# EAGLE schematic Adapter_final (EAGLE 7.7.0)

## Sheet 1 of 3: Power Supply & I/O
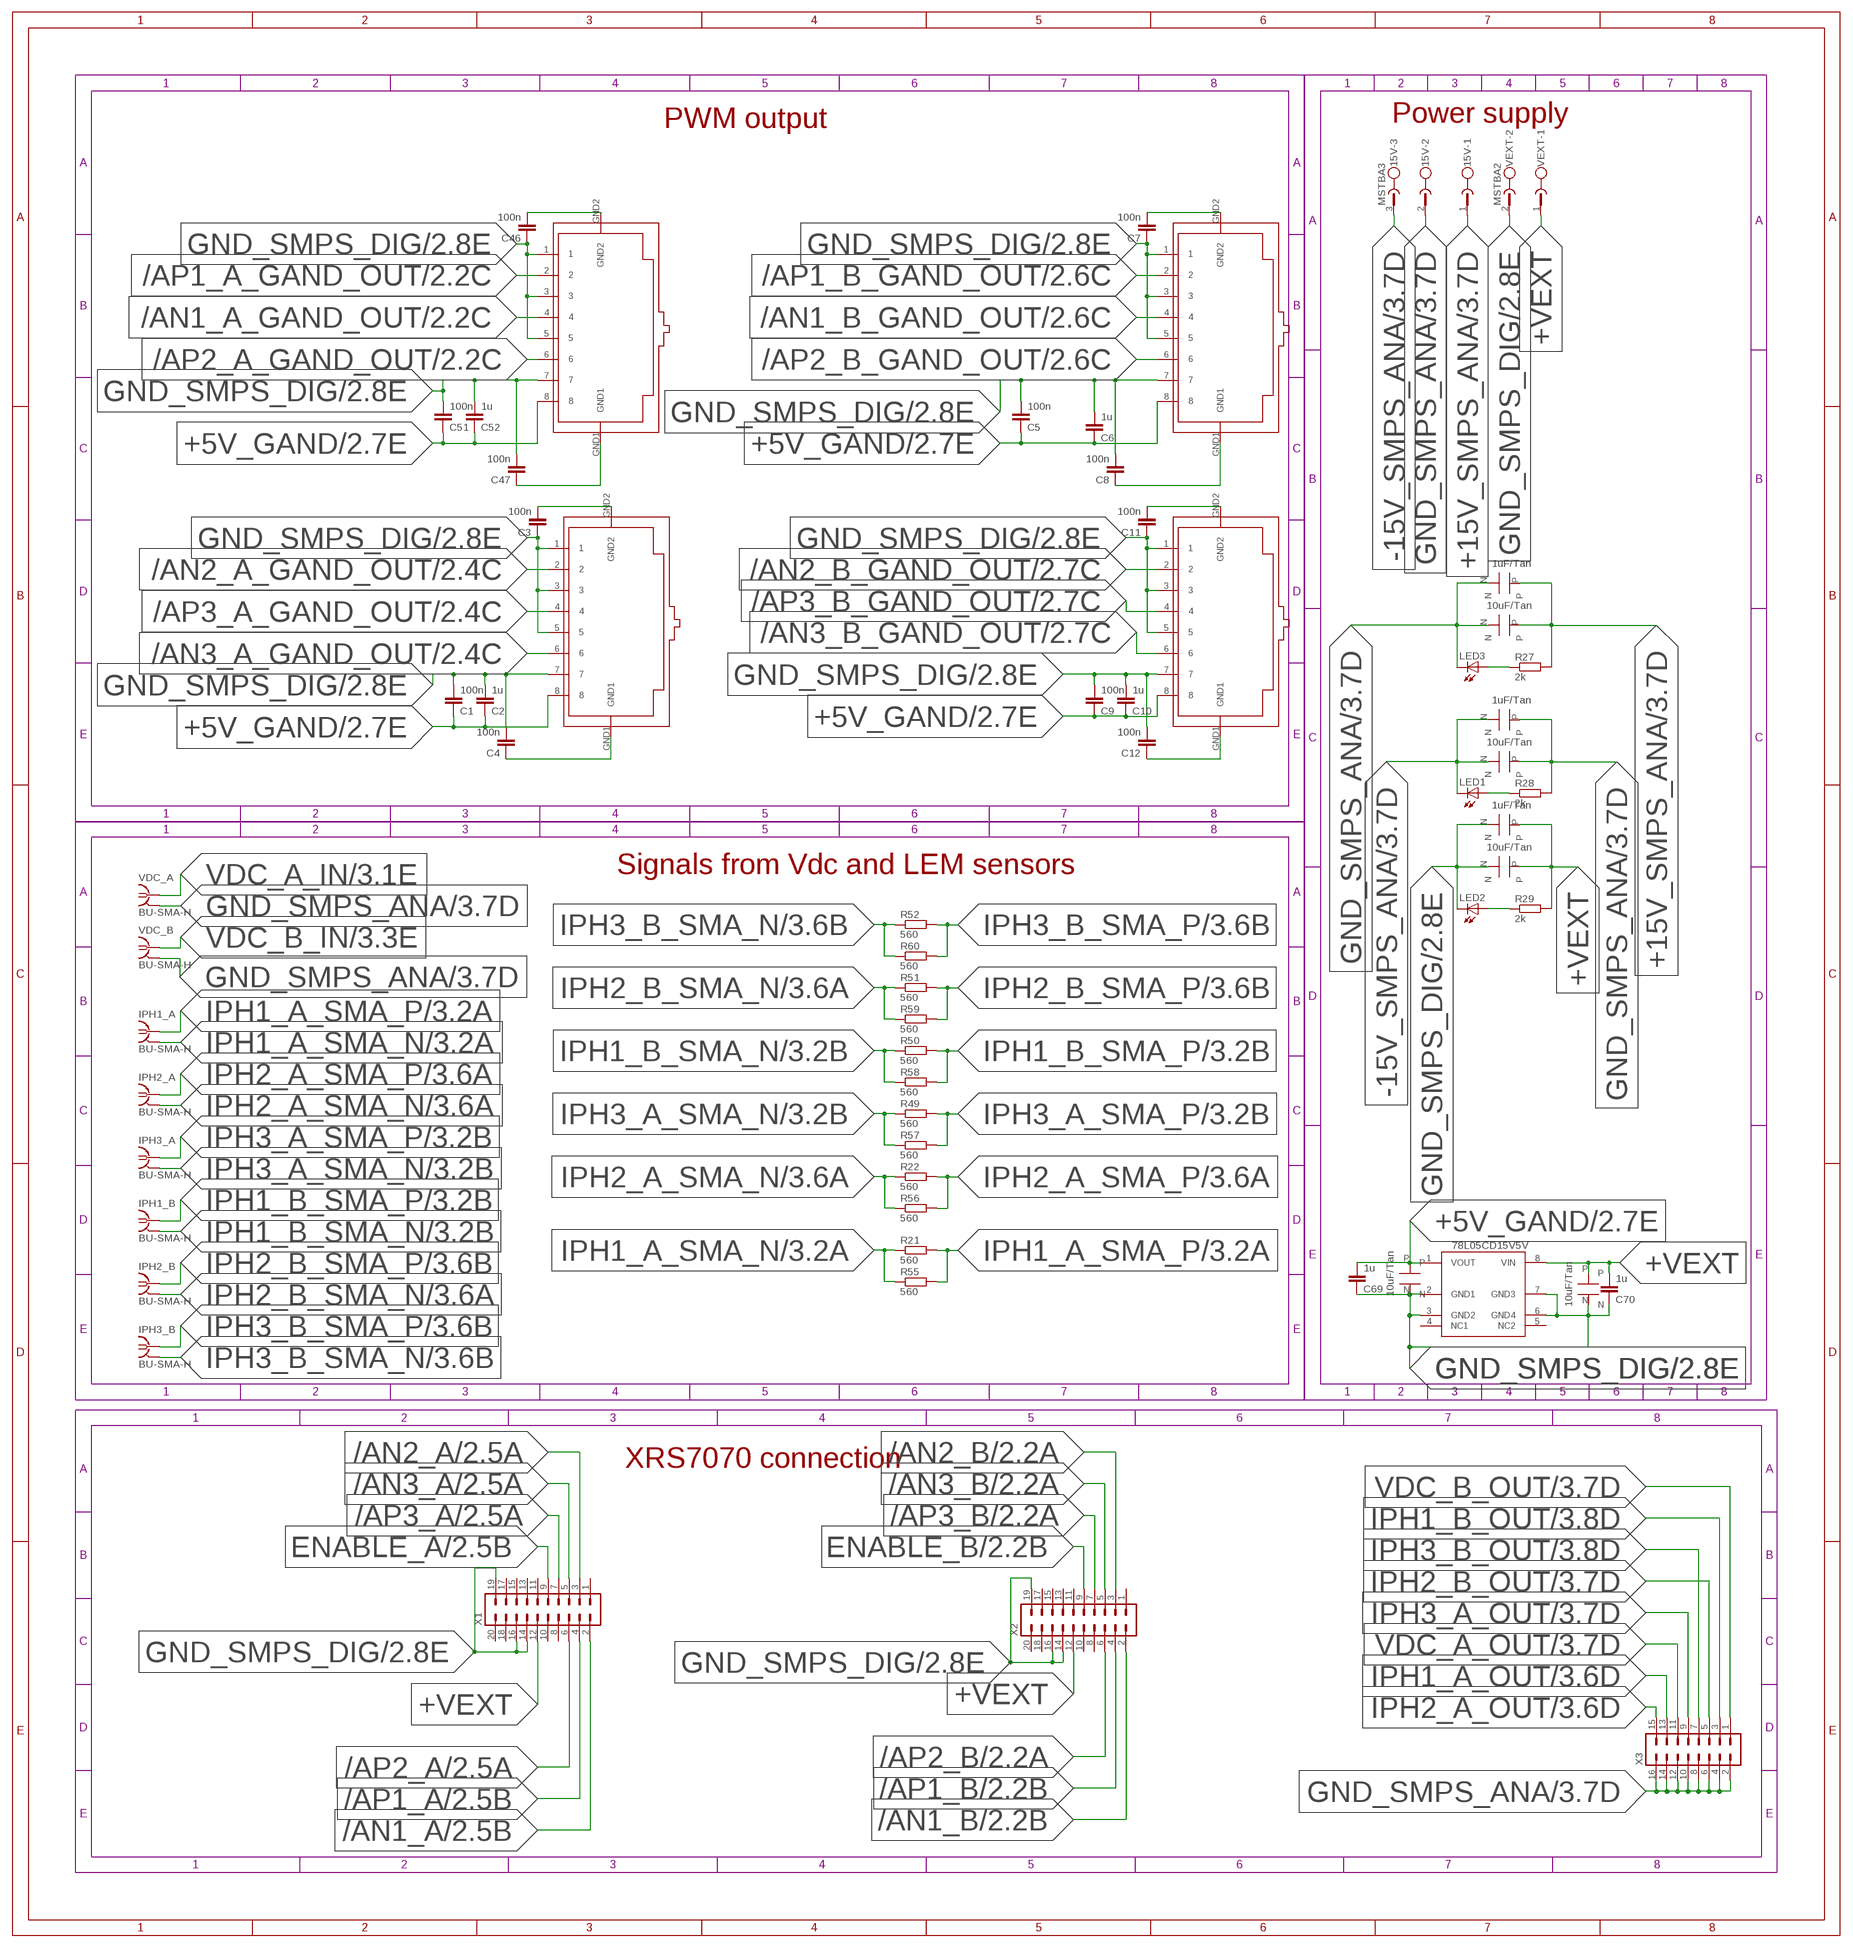
[diagram p0: schematic, sheet 1]

### Parts
15V  MSTBA3  [MSTBA3]
78L05  78L05CD15V5VONLINE  [78L05CD15V5V_LIB]
C1  100n  C-EUC0805  [C0805]
C2  1u  C-EUC0805  [C0805]
C3  100n  C-EUC0805  [C0805]
C4  100n  C-EUC0805  [C0805]
C5  100n  C-EUC0805  [C0805]
C6  1u  C-EUC0805  [C0805]
C7  100n  C-EUC0805  [C0805]
C8  100n  C-EUC0805  [C0805]
C9  100n  C-EUC0805  [C0805]
C10  1u  C-EUC0805  [C0805]
C11  100n  C-EUC0805  [C0805]
C12  100n  C-EUC0805  [C0805]
C46  100n  C-EUC0805  [C0805]
C47  100n  C-EUC0805  [C0805]
C51  100n  C-EUC0805  [C0805]
C52  1u  C-EUC0805  [C0805]
C69  1u  C-EUC0805  [C0805]
C70  1u  C-EUC0805  [C0805]
IPH1_A  BU-SMA-H  [BU-SMA-H]
IPH1_B  BU-SMA-H  [BU-SMA-H]
IPH2_A  BU-SMA-H  [BU-SMA-H]
IPH2_B  BU-SMA-H  [BU-SMA-H]
IPH3_A  BU-SMA-H  [BU-SMA-H]
IPH3_B  BU-SMA-H  [BU-SMA-H]
LED1  LEDCHIPLED_0805  [CHIPLED_0805]
LED2  LEDCHIPLED_0805  [CHIPLED_0805]
LED3  LEDCHIPLED_0805  [CHIPLED_0805]
R21  560  R-EU_R1206  [R1206]
R22  560  R-EU_R1206  [R1206]
R27  2k  R-EU_R0805  [R0805]
R28  2k  R-EU_R0805  [R0805]
R29  2k  R-EU_R0805  [R0805]
R49  560  R-EU_R1206  [R1206]
R50  560  R-EU_R1206  [R1206]
R51  560  R-EU_R1206  [R1206]
R52  560  R-EU_R1206  [R1206]
R55  560  R-EU_R1206  [R1206]
R56  560  R-EU_R1206  [R1206]
R57  560  R-EU_R1206  [R1206]
R58  560  R-EU_R1206  [R1206]
R59  560  R-EU_R1206  [R1206]
R60  560  R-EU_R1206  [R1206]
U$1  RJ45-TRAFO  [RJ45-TRAFO]
U$2  RJ45-TRAFO  [RJ45-TRAFO]
U$3  RJ45-TRAFO  [RJ45-TRAFO]
U$10  TANTALUM_C_1UF_KEMTANTALUM_C_1UF_KEM  [TANTALUM_C_1UF_KEM]
U$11  TANTALUM_C_10UF_KEM  [TANTALUM_C_10UF_KEM]
U$12  TANTALUM_C_1UF_KEMTANTALUM_C_1UF_KEM  [TANTALUM_C_1UF_KEM]
U$14  TANTALUM_C_10UF_KEM  [TANTALUM_C_10UF_KEM]
U$16  TANTALUM_C_1UF_KEMTANTALUM_C_1UF_KEM  [TANTALUM_C_1UF_KEM]
U$17  TANTALUM_C_10UF_KEM  [TANTALUM_C_10UF_KEM]
U$25  TANTALUM_C_10UF_KEM  [TANTALUM_C_10UF_KEM]
U$26  TANTALUM_C_10UF_KEM  [TANTALUM_C_10UF_KEM]
U$50  RJ45-TRAFO  [RJ45-TRAFO]
VDC_A  BU-SMA-H  [BU-SMA-H]
VDC_B  BU-SMA-H  [BU-SMA-H]
VEXT  MSTBA2  [MSTBA2]
X1  ML20  [ML20]
X2  ML20  [ML20]
X3  ML16  [ML16]

### Nets
+5V_GAND: 78L05.1(VOUT) C1.1 C2.1 C5.1 C6.1 C9.1 C10.1 C51.1 C52.1 C69.2 U$1.8 U$2.8 U$3.8 U$25.P U$50.8 ; also sheet 2
+15V_SMPS_ANA: 15V.1 R27.2 U$10.P U$11.P ; also sheet 3
+VEXT: 78L05.8(VIN) C70.2 R29.2 U$16.P U$17.P U$26.P VEXT.1 X1.12 X2.12
-15V_SMPS_ANA: 15V.3 LED1.C U$12.N U$14.N ; also sheet 3
/AN1_A: X1.2 ; also sheet 2
/AN1_A_GAND_OUT: U$50.4 ; also sheet 2
/AN1_B: X2.2 ; also sheet 2
/AN1_B_GAND_OUT: U$2.4 ; also sheet 2
/AN2_A: X1.3 ; also sheet 2
/AN2_A_GAND_OUT: U$1.2 ; also sheet 2
/AN2_B: X2.3 ; also sheet 2
/AN2_B_GAND_OUT: U$3.2 ; also sheet 2
/AN3_A: X1.5 ; also sheet 2
/AN3_A_GAND_OUT: U$1.6 ; also sheet 2
/AN3_B: X2.5 ; also sheet 2
/AN3_B_GAND_OUT: U$3.6 ; also sheet 2
/AP1_A: X1.4 ; also sheet 2
/AP1_A_GAND_OUT: U$50.2 ; also sheet 2
/AP1_B: X2.4 ; also sheet 2
/AP1_B_GAND_OUT: U$2.2 ; also sheet 2
/AP2_A: X1.6 ; also sheet 2
/AP2_A_GAND_OUT: U$50.6 ; also sheet 2
/AP2_B: X2.6 ; also sheet 2
/AP2_B_GAND_OUT: U$2.6 ; also sheet 2
/AP3_A: X1.7 ; also sheet 2
/AP3_A_GAND_OUT: U$1.4 ; also sheet 2
/AP3_B: X2.7 ; also sheet 2
/AP3_B_GAND_OUT: U$3.4 ; also sheet 2
ENABLE_A: X1.9 ; also sheet 2
ENABLE_B: X2.9 ; also sheet 2
GND1_1: C47.1 U$50.GND1
GND1_2: C8.1 U$2.GND1
GND1_5: C4.1 U$1.GND1
GND1_6: C12.1 U$3.GND1
GND2_1: C46.2 U$50.GND2
GND2_2: C7.2 U$2.GND2
GND2_5: C3.2 U$1.GND2
GND2_6: C11.2 U$3.GND2
GND_SMPS_ANA: 15V.2 LED3.C R28.2 U$10.N U$11.N U$12.P U$14.P VDC_A.2 VDC_A.3 VDC_A.4 VDC_A.5 X3.2 X3.4 X3.6 X3.8 X3.10 X3.12 X3.14 X3.16 ; also sheet 3
GND_SMPS_DIG: 78L05.2(GND1) 78L05.3(GND2) 78L05.6(GND4) 78L05.7(GND3) C1.2 C2.2 C3.1 C4.2 C5.2 C6.2 C7.1 C8.2 C9.2 C10.2 C11.1 C12.2 C46.1 C47.2 C51.2 C52.2 C69.1 C70.1 LED2.C U$1.1 U$1.3 U$1.5 U$1.7 U$2.1 U$2.3 U$2.5 U$2.7 U$3.1 U$3.3 U$3.5 U$3.7 U$16.N U$17.N U$25.N U$26.N U$50.1 U$50.3 U$50.5 U$50.7 VEXT.2 X1.14 X1.16 X1.19 X2.14 X2.16 X2.19 ; also sheet 2
IPH1_A_OUT: X3.13 ; also sheet 3
IPH1_A_SMA_N: IPH1_A.2 IPH1_A.3 IPH1_A.4 IPH1_A.5 R21.1 R55.1 ; also sheet 3
IPH1_A_SMA_P: IPH1_A.1 R21.2 R55.2 ; also sheet 3
IPH1_B_OUT: X3.3 ; also sheet 3
IPH1_B_SMA_N: IPH1_B.2 IPH1_B.3 IPH1_B.4 IPH1_B.5 R50.1 R58.1 ; also sheet 3
IPH1_B_SMA_P: IPH1_B.1 R50.2 R58.2 ; also sheet 3
IPH2_A_OUT: X3.15 ; also sheet 3
IPH2_A_SMA_N: IPH2_A.2 IPH2_A.3 IPH2_A.4 IPH2_A.5 R22.1 R56.1 ; also sheet 3
IPH2_A_SMA_P: IPH2_A.1 R22.2 R56.2 ; also sheet 3
IPH2_B_OUT: X3.5 ; also sheet 3
IPH2_B_SMA_N: IPH2_B.2 IPH2_B.3 IPH2_B.4 IPH2_B.5 R51.1 R59.1 ; also sheet 3
IPH2_B_SMA_P: IPH2_B.1 R51.2 R59.2 ; also sheet 3
IPH3_A_OUT: X3.9 ; also sheet 3
IPH3_A_SMA_N: IPH3_A.2 IPH3_A.3 IPH3_A.4 IPH3_A.5 R49.1 R57.1 ; also sheet 3
IPH3_A_SMA_P: IPH3_A.1 R49.2 R57.2 ; also sheet 3
IPH3_B_OUT: X3.7 ; also sheet 3
IPH3_B_SMA_N: IPH3_B.2 IPH3_B.3 IPH3_B.4 IPH3_B.5 R52.1 R60.1 ; also sheet 3
IPH3_B_SMA_P: IPH3_B.1 R52.2 R60.2 ; also sheet 3
N$12: LED3.A R27.1
N$14: LED1.A R28.1
N$16: LED2.A R29.1
VDC_A_IN: VDC_A.1 ; also sheet 3
VDC_A_OUT: X3.11 ; also sheet 3
VDC_B_IN: VDC_B.1 ; also sheet 3
VDC_B_OUT: X3.1 ; also sheet 3
Unconnected: 78L05.4(NC1) 78L05.5(NC2) VDC_B.2 VDC_B.3 VDC_B.4 VDC_B.5 X1.1 X1.8 X1.10 X1.11 X1.13 X1.15 X1.17 X1.18 X1.20 X2.1 X2.8 X2.10 X2.11 X2.13 X2.15 X2.17 X2.18 X2.20

### Notes on the sheet
- PWM output | Power supply
- Signals from Vdc and LEM sensors
- XRS7070 connection

## Sheet 2 of 3: PWM signals Processing
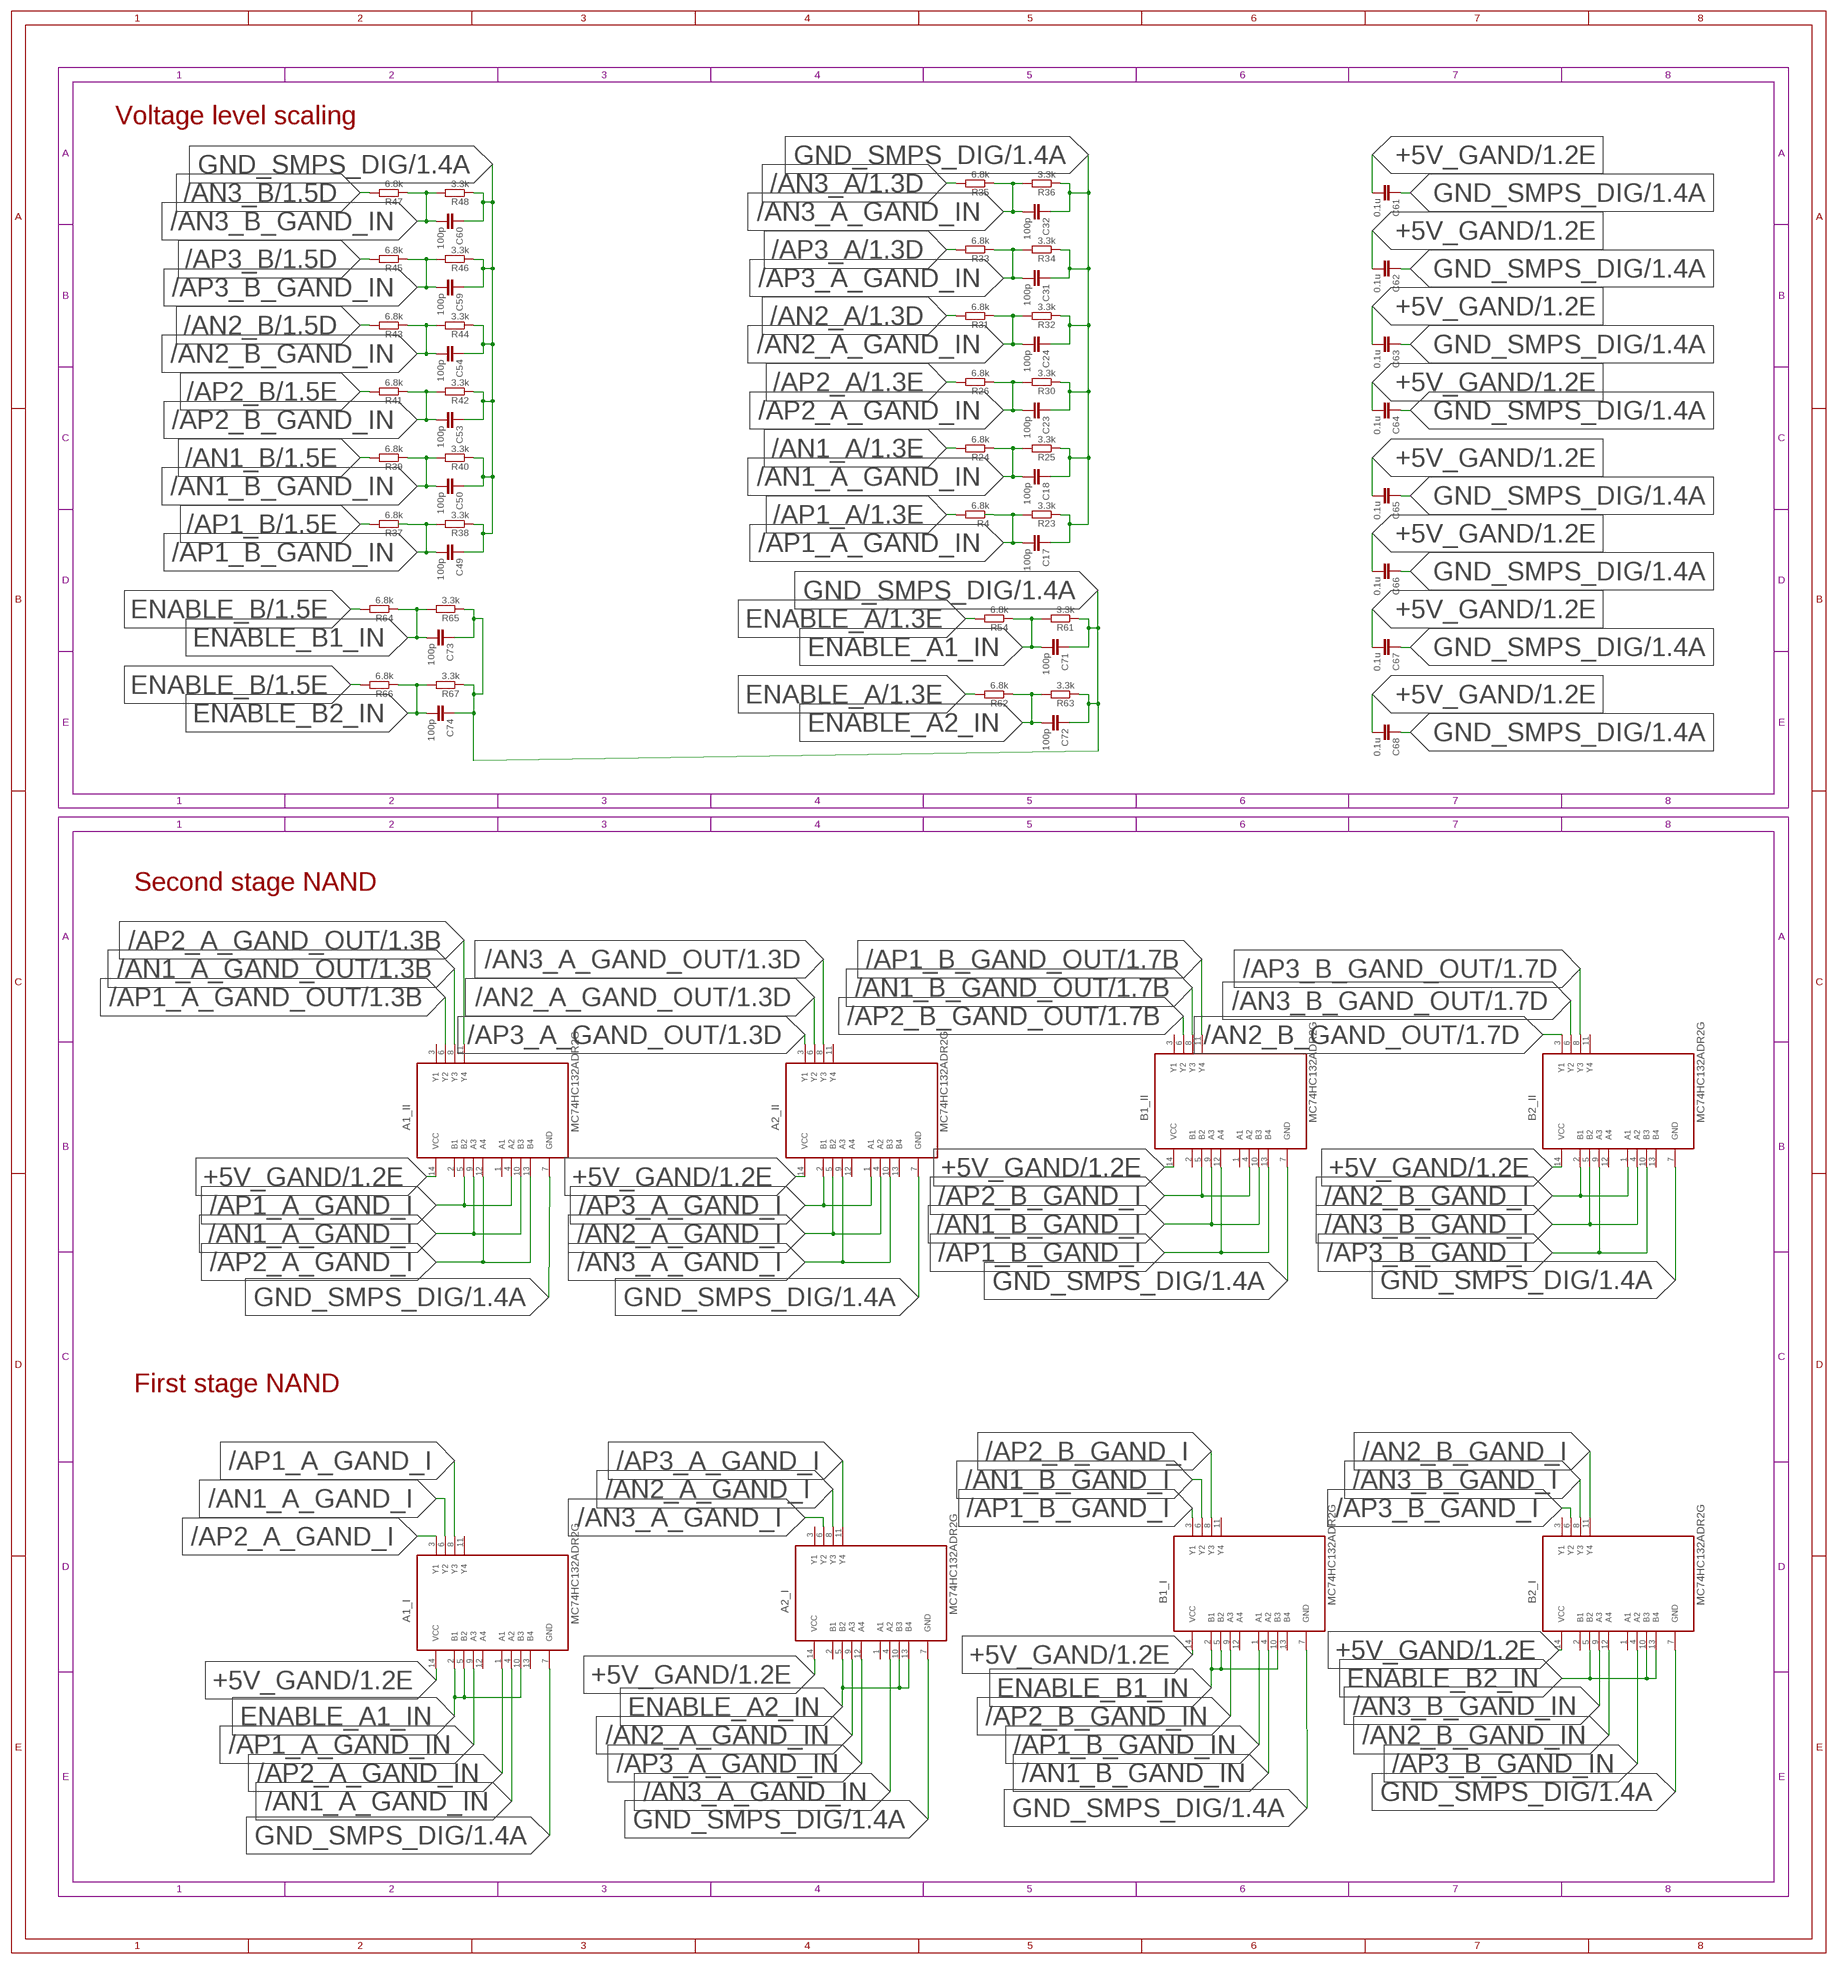
[diagram p1: schematic, sheet 2]

### Parts
A1_I  MC74HC132ADR2G  [SOIC127P600X175-14N]
A1_II  MC74HC132ADR2G  [SOIC127P600X175-14N]
A2_I  MC74HC132ADR2G  [SOIC127P600X175-14N]
A2_II  MC74HC132ADR2G  [SOIC127P600X175-14N]
B1_I  MC74HC132ADR2G  [SOIC127P600X175-14N]
B1_II  MC74HC132ADR2G  [SOIC127P600X175-14N]
B2_I  MC74HC132ADR2G  [SOIC127P600X175-14N]
B2_II  MC74HC132ADR2G  [SOIC127P600X175-14N]
C17  100p  C-EUC0805  [C0805]
C18  100p  C-EUC0805  [C0805]
C23  100p  C-EUC0805  [C0805]
C24  100p  C-EUC0805  [C0805]
C31  100p  C-EUC0805  [C0805]
C32  100p  C-EUC0805  [C0805]
C49  100p  C-EUC0805  [C0805]
C50  100p  C-EUC0805  [C0805]
C53  100p  C-EUC0805  [C0805]
C54  100p  C-EUC0805  [C0805]
C59  100p  C-EUC0805  [C0805]
C60  100p  C-EUC0805  [C0805]
C61  0.1u  C-EUC0805  [C0805]
C62  0.1u  C-EUC0805  [C0805]
C63  0.1u  C-EUC0805  [C0805]
C64  0.1u  C-EUC0805  [C0805]
C65  0.1u  C-EUC0805  [C0805]
C66  0.1u  C-EUC0805  [C0805]
C67  0.1u  C-EUC0805  [C0805]
C68  0.1u  C-EUC0805  [C0805]
C71  100p  C-EUC0805  [C0805]
C72  100p  C-EUC0805  [C0805]
C73  100p  C-EUC0805  [C0805]
C74  100p  C-EUC0805  [C0805]
R4  6.8k  R-EU_R0805  [R0805]
R23  3.3k  R-EU_R0805  [R0805]
R24  6.8k  R-EU_R0805  [R0805]
R25  3.3k  R-EU_R0805  [R0805]
R26  6.8k  R-EU_R0805  [R0805]
R30  3.3k  R-EU_R0805  [R0805]
R31  6.8k  R-EU_R0805  [R0805]
R32  3.3k  R-EU_R0805  [R0805]
R33  6.8k  R-EU_R0805  [R0805]
R34  3.3k  R-EU_R0805  [R0805]
R35  6.8k  R-EU_R0805  [R0805]
R36  3.3k  R-EU_R0805  [R0805]
R37  6.8k  R-EU_R0805  [R0805]
R38  3.3k  R-EU_R0805  [R0805]
R39  6.8k  R-EU_R0805  [R0805]
R40  3.3k  R-EU_R0805  [R0805]
R41  6.8k  R-EU_R0805  [R0805]
R42  3.3k  R-EU_R0805  [R0805]
R43  6.8k  R-EU_R0805  [R0805]
R44  3.3k  R-EU_R0805  [R0805]
R45  6.8k  R-EU_R0805  [R0805]
R46  3.3k  R-EU_R0805  [R0805]
R47  6.8k  R-EU_R0805  [R0805]
R48  3.3k  R-EU_R0805  [R0805]
R54  6.8k  R-EU_R0805  [R0805]
R61  3.3k  R-EU_R0805  [R0805]
R62  6.8k  R-EU_R0805  [R0805]
R63  3.3k  R-EU_R0805  [R0805]
R64  6.8k  R-EU_R0805  [R0805]
R65  3.3k  R-EU_R0805  [R0805]
R66  6.8k  R-EU_R0805  [R0805]
R67  3.3k  R-EU_R0805  [R0805]

### Nets
+5V_GAND: A1_I.14(VCC) A1_II.14(VCC) A2_I.14(VCC) A2_II.14(VCC) B1_I.14(VCC) B1_II.14(VCC) B2_I.14(VCC) B2_II.14(VCC) C61.2 C62.2 C63.2 C64.2 C65.2 C66.2 C67.2 C68.2 ; also sheet 1
/AN1_A: R24.2 ; also sheet 1
/AN1_A_GAND_I: A1_I.6(Y2) A1_II.9(A3) A1_II.10(B3)
/AN1_A_GAND_IN: A1_I.4(A2) C18.2 R24.1 R25.2
/AN1_A_GAND_OUT: A1_II.8(Y3) ; also sheet 1
/AN1_B: R39.2 ; also sheet 1
/AN1_B_GAND_I: B1_I.6(Y2) B1_II.9(A3) B1_II.10(B3)
/AN1_B_GAND_IN: B1_I.4(A2) C50.2 R39.1 R40.2
/AN1_B_GAND_OUT: B1_II.8(Y3) ; also sheet 1
/AN2_A: R31.2 ; also sheet 1
/AN2_A_GAND_I: A2_I.8(Y3) A2_II.4(A2) A2_II.5(B2)
/AN2_A_GAND_IN: A2_I.9(A3) C24.2 R31.1 R32.2
/AN2_A_GAND_OUT: A2_II.6(Y2) ; also sheet 1
/AN2_B: R43.2 ; also sheet 1
/AN2_B_GAND_I: B2_I.11(Y4) B2_II.1(A1) B2_II.2(B1)
/AN2_B_GAND_IN: B2_I.12(A4) C54.2 R43.1 R44.2
/AN2_B_GAND_OUT: B2_II.3(Y1) ; also sheet 1
/AN3_A: R35.2 ; also sheet 1
/AN3_A_GAND_I: A2_I.6(Y2) A2_II.9(A3) A2_II.10(B3)
/AN3_A_GAND_IN: A2_I.4(A2) C32.2 R35.1 R36.2
/AN3_A_GAND_OUT: A2_II.8(Y3) ; also sheet 1
/AN3_B: R47.2 ; also sheet 1
/AN3_B_GAND_I: B2_I.8(Y3) B2_II.4(A2) B2_II.5(B2)
/AN3_B_GAND_IN: B2_I.9(A3) C60.2 R47.1 R48.2
/AN3_B_GAND_OUT: B2_II.6(Y2) ; also sheet 1
/AP1_A: R4.2 ; also sheet 1
/AP1_A_GAND_I: A1_I.8(Y3) A1_II.4(A2) A1_II.5(B2)
/AP1_A_GAND_IN: A1_I.9(A3) C17.2 R4.1 R23.2
/AP1_A_GAND_OUT: A1_II.6(Y2) ; also sheet 1
/AP1_B: R37.2 ; also sheet 1
/AP1_B_GAND_I: B1_I.3(Y1) B1_II.12(A4) B1_II.13(B4)
/AP1_B_GAND_IN: B1_I.1(A1) C49.2 R37.1 R38.2
/AP1_B_GAND_OUT: B1_II.11(Y4) ; also sheet 1
/AP2_A: R26.2 ; also sheet 1
/AP2_A_GAND_I: A1_I.3(Y1) A1_II.12(A4) A1_II.13(B4)
/AP2_A_GAND_IN: A1_I.1(A1) C23.2 R26.1 R30.2
/AP2_A_GAND_OUT: A1_II.11(Y4) ; also sheet 1
/AP2_B: R41.2 ; also sheet 1
/AP2_B_GAND_I: B1_I.8(Y3) B1_II.4(A2) B1_II.5(B2)
/AP2_B_GAND_IN: B1_I.9(A3) C53.2 R41.1 R42.2
/AP2_B_GAND_OUT: B1_II.6(Y2) ; also sheet 1
/AP3_A: R33.2 ; also sheet 1
/AP3_A_GAND_I: A2_I.11(Y4) A2_II.1(A1) A2_II.2(B1)
/AP3_A_GAND_IN: A2_I.12(A4) C31.2 R33.1 R34.2
/AP3_A_GAND_OUT: A2_II.3(Y1) ; also sheet 1
/AP3_B: R45.2 ; also sheet 1
/AP3_B_GAND_I: B2_I.6(Y2) B2_II.9(A3) B2_II.10(B3)
/AP3_B_GAND_IN: B2_I.4(A2) C59.2 R45.1 R46.2
/AP3_B_GAND_OUT: B2_II.8(Y3) ; also sheet 1
ENABLE_A: R54.2 R62.2 ; also sheet 1
ENABLE_A1_IN: A1_I.2(B1) A1_I.5(B2) A1_I.10(B3) C71.2 R54.1 R61.2
ENABLE_A2_IN: A2_I.5(B2) A2_I.10(B3) A2_I.13(B4) C72.2 R62.1 R63.2
ENABLE_B: R64.2 R66.2 ; also sheet 1
ENABLE_B1_IN: B1_I.2(B1) B1_I.5(B2) B1_I.10(B3) C73.2 R64.1 R65.2
ENABLE_B2_IN: B2_I.5(B2) B2_I.10(B3) B2_I.13(B4) C74.2 R66.1 R67.2
GND_SMPS_DIG: A1_I.7(GND) A1_II.7(GND) A2_I.7(GND) A2_II.7(GND) B1_I.7(GND) B1_II.7(GND) B2_I.7(GND) B2_II.7(GND) C17.1 C18.1 C23.1 C24.1 C31.1 C32.1 C49.1 C50.1 C53.1 C54.1 C59.1 C60.1 C61.1 C62.1 C63.1 C64.1 C65.1 C66.1 C67.1 C68.1 C71.1 C72.1 C73.1 C74.1 R23.1 R25.1 R30.1 R32.1 R34.1 R36.1 R38.1 R40.1 R42.1 R44.1 R46.1 R48.1 R61.1 R63.1 R65.1 R67.1 ; also sheet 1
Unconnected: A1_I.11(Y4) A1_I.12(A4) A1_I.13(B4) A1_II.1(A1) A1_II.2(B1) A1_II.3(Y1) A2_I.1(A1) A2_I.2(B1) A2_I.3(Y1) A2_II.11(Y4) A2_II.12(A4) A2_II.13(B4) B1_I.11(Y4) B1_I.12(A4) B1_I.13(B4) B1_II.1(A1) B1_II.2(B1) B1_II.3(Y1) B2_I.1(A1) B2_I.2(B1) B2_I.3(Y1) B2_II.11(Y4) B2_II.12(A4) B2_II.13(B4)

### Notes on the sheet
- Voltage level scaling
- Second stage NAND
- First stage NAND

## Sheet 3 of 3: Analog Filtering
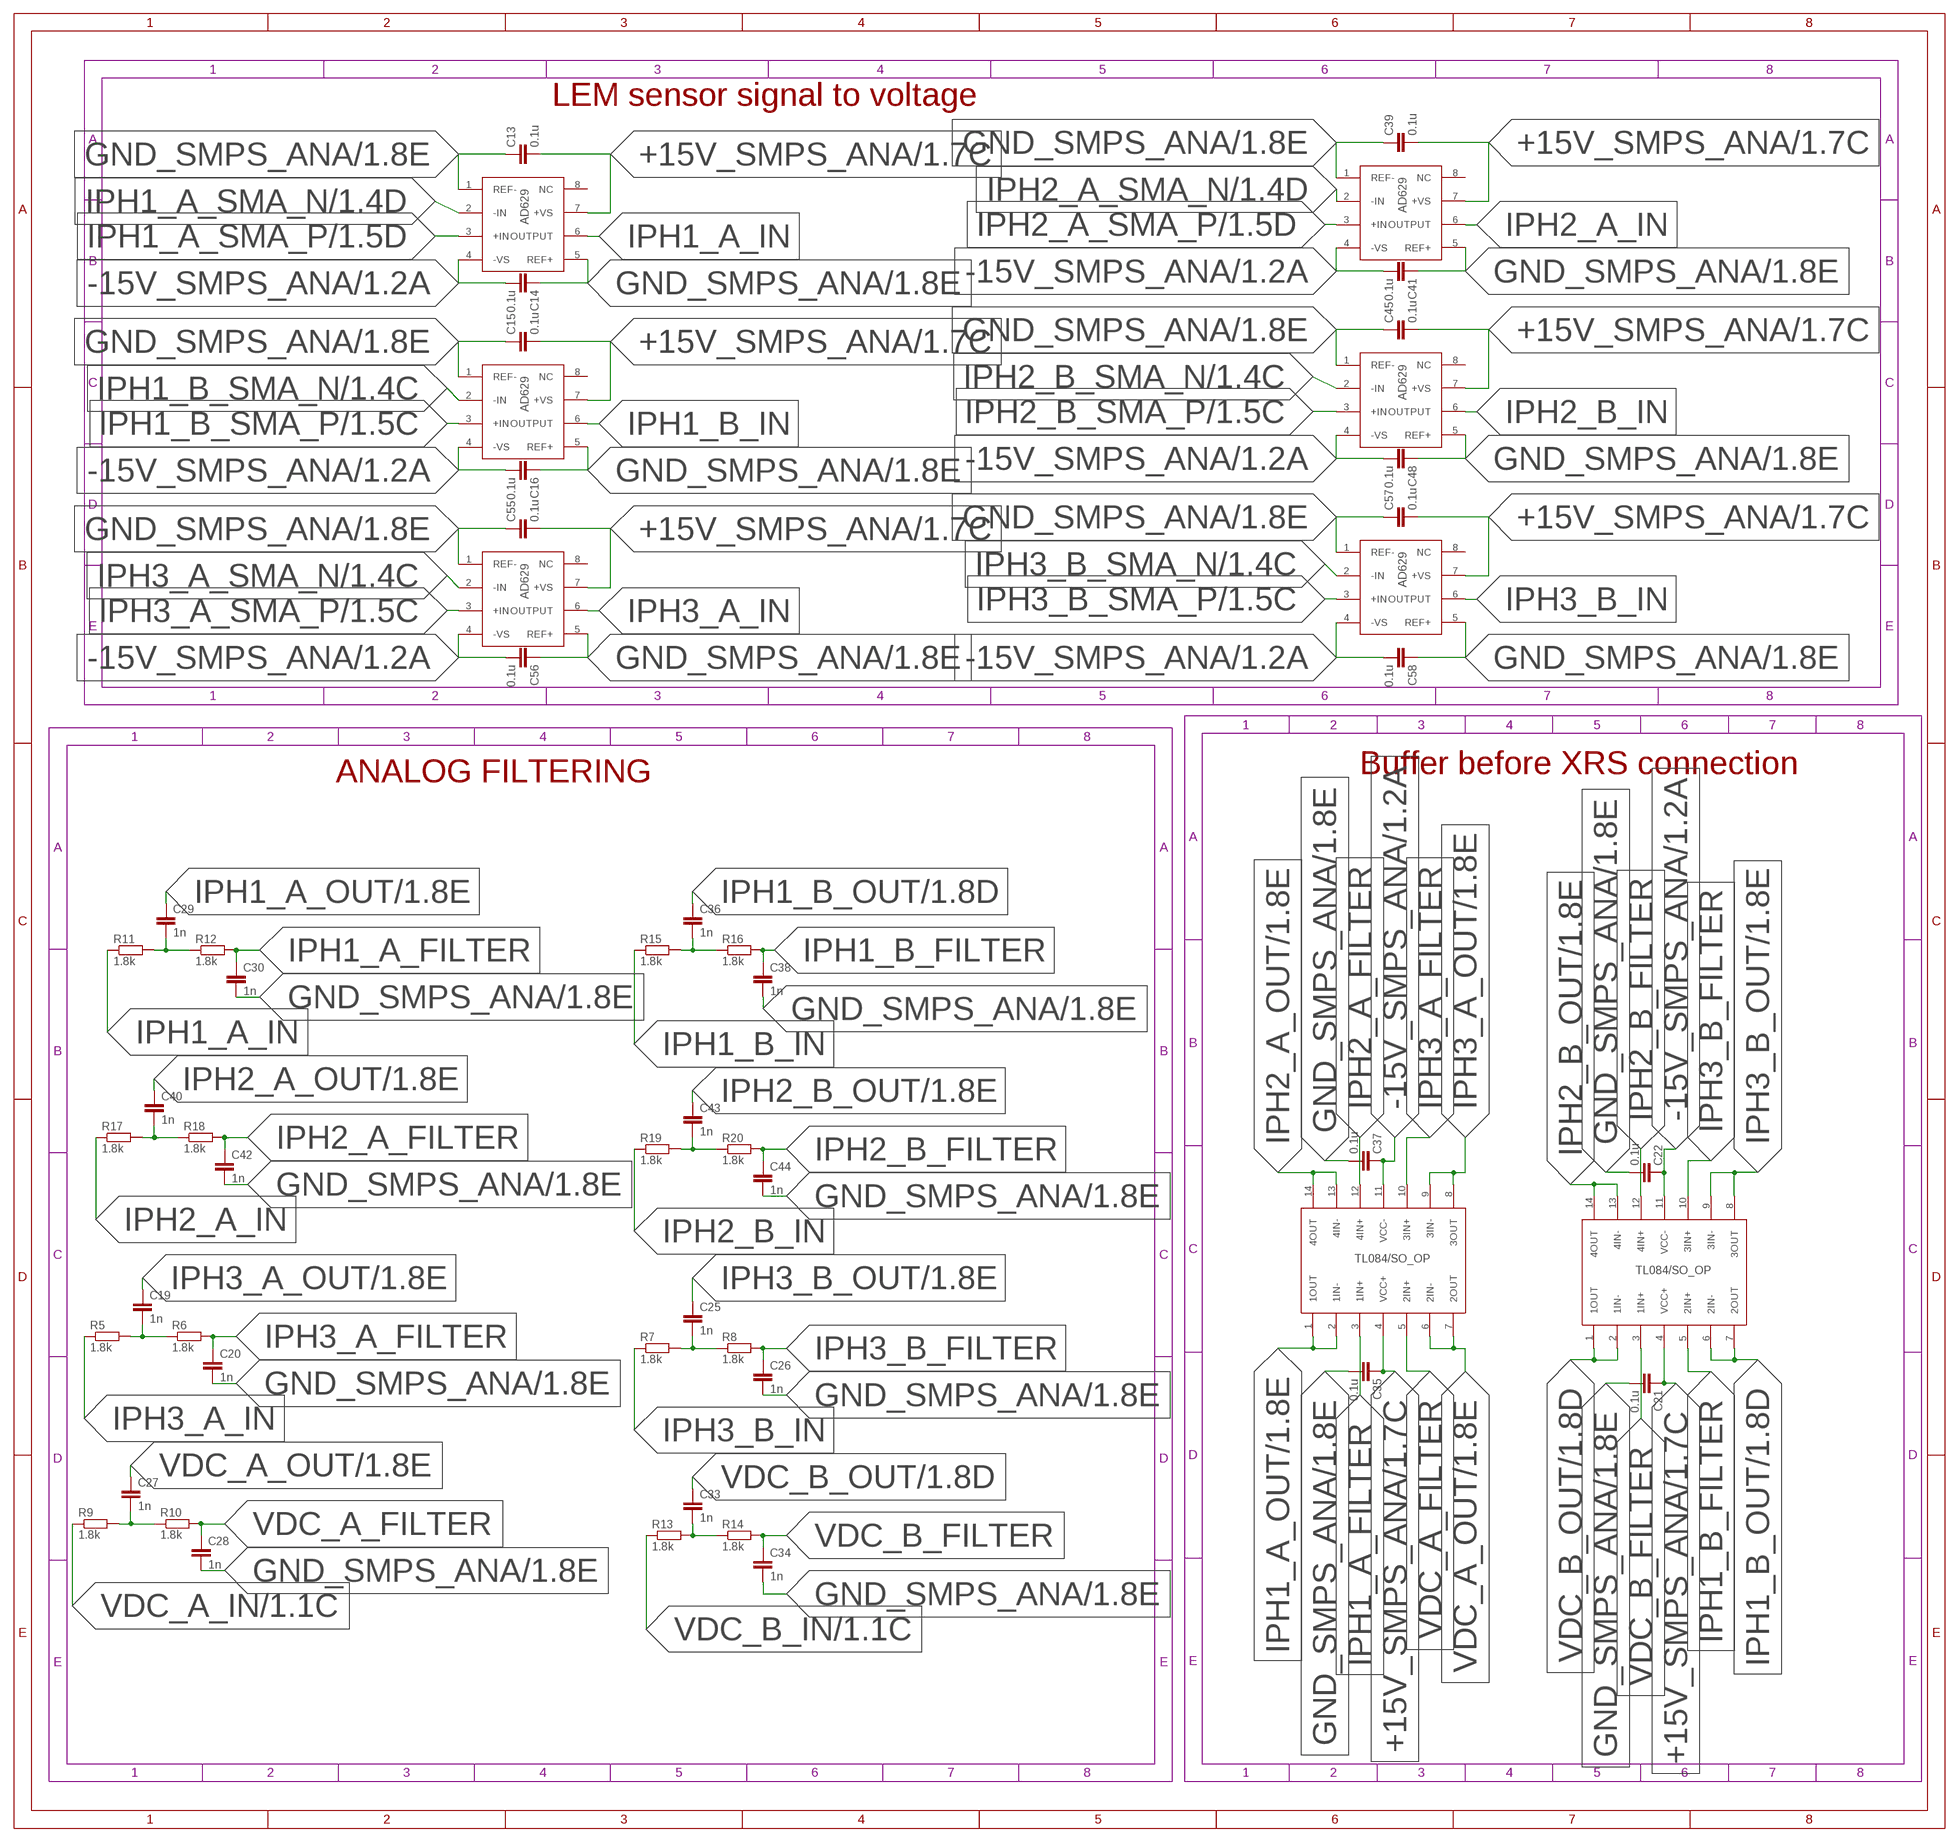
[diagram p2: schematic, sheet 3]

### Parts
C13  0.1u  C-EUC0805  [C0805]
C14  0.1u  C-EUC0805  [C0805]
C15  0.1u  C-EUC0805  [C0805]
C16  0.1u  C-EUC0805  [C0805]
C19  1n  C-EUC0805  [C0805]
C20  1n  C-EUC0805  [C0805]
C21  0.1u  C-EUC0805  [C0805]
C22  0.1u  C-EUC0805  [C0805]
C25  1n  C-EUC0805  [C0805]
C26  1n  C-EUC0805  [C0805]
C27  1n  C-EUC0805  [C0805]
C28  1n  C-EUC0805  [C0805]
C29  1n  C-EUC0805  [C0805]
C30  1n  C-EUC0805  [C0805]
C33  1n  C-EUC0805  [C0805]
C34  1n  C-EUC0805  [C0805]
C35  0.1u  C-EUC0805  [C0805]
C36  1n  C-EUC0805  [C0805]
C37  0.1u  C-EUC0805  [C0805]
C38  1n  C-EUC0805  [C0805]
C39  0.1u  C-EUC0805  [C0805]
C40  1n  C-EUC0805  [C0805]
C41  0.1u  C-EUC0805  [C0805]
C42  1n  C-EUC0805  [C0805]
C43  1n  C-EUC0805  [C0805]
C44  1n  C-EUC0805  [C0805]
C45  0.1u  C-EUC0805  [C0805]
C48  0.1u  C-EUC0805  [C0805]
C55  0.1u  C-EUC0805  [C0805]
C56  0.1u  C-EUC0805  [C0805]
C57  0.1u  C-EUC0805  [C0805]
C58  0.1u  C-EUC0805  [C0805]
R5  1.8k  R-EU_R0805  [R0805]
R6  1.8k  R-EU_R0805  [R0805]
R7  1.8k  R-EU_R0805  [R0805]
R8  1.8k  R-EU_R0805  [R0805]
R9  1.8k  R-EU_R0805  [R0805]
R10  1.8k  R-EU_R0805  [R0805]
R11  1.8k  R-EU_R0805  [R0805]
R12  1.8k  R-EU_R0805  [R0805]
R13  1.8k  R-EU_R0805  [R0805]
R14  1.8k  R-EU_R0805  [R0805]
R15  1.8k  R-EU_R0805  [R0805]
R16  1.8k  R-EU_R0805  [R0805]
R17  1.8k  R-EU_R0805  [R0805]
R18  1.8k  R-EU_R0805  [R0805]
R19  1.8k  R-EU_R0805  [R0805]
R20  1.8k  R-EU_R0805  [R0805]
U$5  TL084/SO_OPONLINE  [TL084/SO_OP_LIB]
U$15  TL084/SO_OPONLINE  [TL084/SO_OP_LIB]
U$18  AD629_DIFFAONLINE  [AD629_DIFFA_LIB]
U$19  AD629_DIFFAONLINE  [AD629_DIFFA_LIB]
U$20  AD629_DIFFAONLINE  [AD629_DIFFA_LIB]
U$21  AD629_DIFFAONLINE  [AD629_DIFFA_LIB]
U$22  AD629_DIFFAONLINE  [AD629_DIFFA_LIB]
U$23  AD629_DIFFAONLINE  [AD629_DIFFA_LIB]

### Nets
+15V_SMPS_ANA: C13.2 C15.2 C21.1 C35.1 C39.2 C45.2 C55.2 C57.2 U$5.4(VCC+) U$15.4(VCC+) U$18.7(+VS) U$19.7(+VS) U$20.7(+VS) U$21.7(+VS) U$22.7(+VS) U$23.7(+VS) ; also sheet 1
-15V_SMPS_ANA: C14.2 C16.2 C22.1 C37.1 C41.2 C48.2 C56.2 C58.2 U$5.11(VCC-) U$15.11(VCC-) U$18.4(-VS) U$19.4(-VS) U$20.4(-VS) U$21.4(-VS) U$22.4(-VS) U$23.4(-VS) ; also sheet 1
GND_SMPS_ANA: C13.1 C14.1 C15.1 C16.1 C20.2 C21.2 C22.2 C26.2 C28.2 C30.2 C34.2 C35.2 C37.2 C38.2 C39.1 C41.1 C42.2 C44.2 C45.1 C48.1 C55.1 C56.1 C57.1 C58.1 U$18.1(REF-) U$18.5(REF+) U$19.1(REF-) U$19.5(REF+) U$20.1(REF-) U$20.5(REF+) U$21.1(REF-) U$21.5(REF+) U$22.1(REF-) U$22.5(REF+) U$23.1(REF-) U$23.5(REF+) ; also sheet 1
IPH1_A_FILTER: C30.1 R12.2 U$15.3(1IN+)
IPH1_A_IN: R11.1 U$18.6(OUTPUT)
IPH1_A_OUT: C29.1 U$15.1(1OUT) U$15.2(1IN-) ; also sheet 1
IPH1_A_SMA_N: U$18.2(-IN) ; also sheet 1
IPH1_A_SMA_P: U$18.3(+IN) ; also sheet 1
IPH1_B_FILTER: C38.1 R16.2 U$5.5(2IN+)
IPH1_B_IN: R15.1 U$19.6(OUTPUT)
IPH1_B_OUT: C36.1 U$5.6(2IN-) U$5.7(2OUT) ; also sheet 1
IPH1_B_SMA_N: U$19.2(-IN) ; also sheet 1
IPH1_B_SMA_P: U$19.3(+IN) ; also sheet 1
IPH2_A_FILTER: C42.1 R18.2 U$15.12(4IN+)
IPH2_A_IN: R17.1 U$20.6(OUTPUT)
IPH2_A_OUT: C40.1 U$15.13(4IN-) U$15.14(4OUT) ; also sheet 1
IPH2_A_SMA_N: U$20.2(-IN) ; also sheet 1
IPH2_A_SMA_P: U$20.3(+IN) ; also sheet 1
IPH2_B_FILTER: C44.1 R20.2 U$5.12(4IN+)
IPH2_B_IN: R19.1 U$21.6(OUTPUT)
IPH2_B_OUT: C43.1 U$5.13(4IN-) U$5.14(4OUT) ; also sheet 1
IPH2_B_SMA_N: U$21.2(-IN) ; also sheet 1
IPH2_B_SMA_P: U$21.3(+IN) ; also sheet 1
IPH3_A_FILTER: C20.1 R6.2 U$15.10(3IN+)
IPH3_A_IN: R5.1 U$22.6(OUTPUT)
IPH3_A_OUT: C19.1 U$15.8(3OUT) U$15.9(3IN-) ; also sheet 1
IPH3_A_SMA_N: U$22.2(-IN) ; also sheet 1
IPH3_A_SMA_P: U$22.3(+IN) ; also sheet 1
IPH3_B_FILTER: C26.1 R8.2 U$5.10(3IN+)
IPH3_B_IN: R7.1 U$23.6(OUTPUT)
IPH3_B_OUT: C25.1 U$5.8(3OUT) U$5.9(3IN-) ; also sheet 1
IPH3_B_SMA_N: U$23.2(-IN) ; also sheet 1
IPH3_B_SMA_P: U$23.3(+IN) ; also sheet 1
N$1: C19.2 R5.2 R6.1
N$2: C25.2 R7.2 R8.1
N$3: C27.2 R9.2 R10.1
N$4: C29.2 R11.2 R12.1
N$5: C33.2 R13.2 R14.1
N$6: C36.2 R15.2 R16.1
N$7: C40.2 R17.2 R18.1
N$8: C43.2 R19.2 R20.1
VDC_A_FILTER: C28.1 R10.2 U$15.5(2IN+)
VDC_A_IN: R9.1 ; also sheet 1
VDC_A_OUT: C27.1 U$15.6(2IN-) U$15.7(2OUT) ; also sheet 1
VDC_B_FILTER: C34.1 R14.2 U$5.3(1IN+)
VDC_B_IN: R13.1 ; also sheet 1
VDC_B_OUT: C33.1 U$5.1(1OUT) U$5.2(1IN-) ; also sheet 1
Unconnected: U$18.8(NC) U$19.8(NC) U$20.8(NC) U$21.8(NC) U$22.8(NC) U$23.8(NC)

### Notes on the sheet
- LEM sensor signal to voltage
- ANALOG FILTERING | Buffer before XRS connection

## Library data of the parts
15V = con-phoenix-508:MSTBA3: PHOENIX; MF: FARNELL; MPN: 1757255; OC_FARNELL: 3705183; OC_NEWARK: 71C4162
78L05 = Submodule:78L05CD15V5V: 78L05CD 15 V- 5 V voltage regulator
A1_I A1_II A2_I A2_II B1_I B1_II B2_I B2_II = ON Semiconductor_By_element14_Batch_1:MC74HC132ADR2G: Quad 2-Input NAND Gate with Schmitt-Trigger Inputs; MPN: MC74HC132ADR2G; OC_FARNELL: 1268658; OC_NEWARK: 84K8775; PACKAGE: SOIC-14; SUPPLIER: ON SEMICONDUCTOR
C1-C74 = rcl:C-EU: CAPACITOR, European symbol
IPH1_A IPH1_B IPH2_A IPH2_B IPH3_A IPH3_B VDC_A VDC_B = con-coax:BU-SMA-H: FEMALE SMA CONNECTOR Radiall; OC_FARNELL: unknown; OC_NEWARK: unknown
LED1-LED3 = led:LED: LED OSRAM: - CHIPLED LG R971, LG N971, LY N971, LG Q971, LY Q971, LO R971, LY R971 LH N974, LH R974 LS Q976, LO Q976, LY Q976 LO Q996 - Hyper CHIPLED LW Q18S LB Q993, LB Q99A, LB R99A - SideLED LS A670, LO A670, LY A670, LG A670, LP A670 LB A673, LV A673, LT A673, LW A673 LH A674 LY A675 LS A676, LA A676, LO A676, LY A676, LW A676 LS A679, LY A679, LG A679 - Hyper Micro SIDELED® LS Y876, LA Y876, LO Y876, LY Y876 LT Y87S - SmartLED LW L88C, LW L88S LB L89C, LB L89S, LG L890 LS L89K, LO L89K, LY L89K LS L896, LA L896, LO L896, LY L896 - TOPLED LS T670, LO T670, LY T670, LG T670, LP T670 LSG T670, LSP T670, LSY T670, LOP T670, LYG T670 LG T671, LOG T671, LSG T671 LB T673, LV T673, LT T673, LW T673 LH T674 LS T676, LA T676, LO T676, LY T676, LB T676, LH T676, LSB T676, LW T676 LB T67C, LV T67C, LT T67C, LS T67K, LO T67K, LY T67K, LW E67C LS E67B, LA E67B, LO E67B, LY E67B, LB E67C, LV E67C, LT E67C LW T67C LS T679, LY T679, LG T679 LS T770, LO T770, LY T770, LG T770, LP T770 LB T773, LV T773, LT T773, LW T773 LH T774 LS E675, LA E675, LY E675, LS T675 LS T776, LA T776, LO T776, LY T776, LB T776 LHGB T686 LT T68C, LB T68C - Hyper Mini TOPLED® LB M676 - Mini TOPLED Santana® LG M470 LS M47K, LO M47K, LY M47K Source: http://www.osram.convergy.de LUXEON: - LUMILED® LXK2-PW12-R00, LXK2-PW12-S00, LXK2-PW14-U00, LXK2-PW14-V00 LXK2-PM12-R00, LXK2-PM12-S00, LXK2-PM14-U00 LXK2-PE12-Q00, LXK2-PE12-R00, LXK2-PE12-S00, LXK2-PE14-T00, LXK2-PE14-U00 LXK2-PB12-K00, LXK2-PB12-L00, LXK2-PB12-M00, LXK2-PB14-N00, LXK2-PB14-P00, LXK2-PB14-Q00 LXK2-PR12-L00, LXK2-PR12-M00, LXK2-PR14-Q00, LXK2-PR14-R00 LXK2-PD12-Q00, LXK2-PD12-R00, LXK2-PD12-S00 LXK2-PH12-R00, LXK2-PH12-S00 LXK2-PL12-P00, LXK2-PL12-Q00, LXK2-PL12-R00 Source: www.luxeon.com KINGBRIGHT: KA-3528ASYC Source: www.kingbright.com
R4-R52 R54-R67 = rcl:R-EU_: RESISTOR, European symbol
U$1-U$3 U$50 = con-amphenol-rj45-ld:RJ45-TRAFO: RJ45 socket with integrated magnetics Naming: Amphenol LMJ1598824110DT39 TME RJ45-TRAFO Author: Petr Kalandra <mailto:kalandrap@gmail.com> Datasheet: http://zefiryn.tme.pl/dok/zlacza/rjtrafo.pdf
U$5 U$15 = Submodule:TL084/SO_OP
U$10 U$12 U$16 = Submodule:TANTALUM_C_1UF_KEM
U$11 U$14 U$17 U$25 U$26 = Submodule:TANTALUM_C_10UF_KEM
U$18-U$23 = Submodule:AD629_DIFFA
VEXT = con-phoenix-508:MSTBA2: PHOENIX; MF: FARNELL; MPN: 1757242; OC_FARNELL: 3705171; OC_NEWARK: 71C4161
X1 X2 = con-harting-ml:ML20: HARTING; OC_FARNELL: unknown; OC_NEWARK: unknown
X3 = con-harting-ml:ML16: HARTING; OC_FARNELL: unknown; OC_NEWARK: unknown